# EAGLE design Non-Contact Switch v1 (EAGLE 9.6.0)
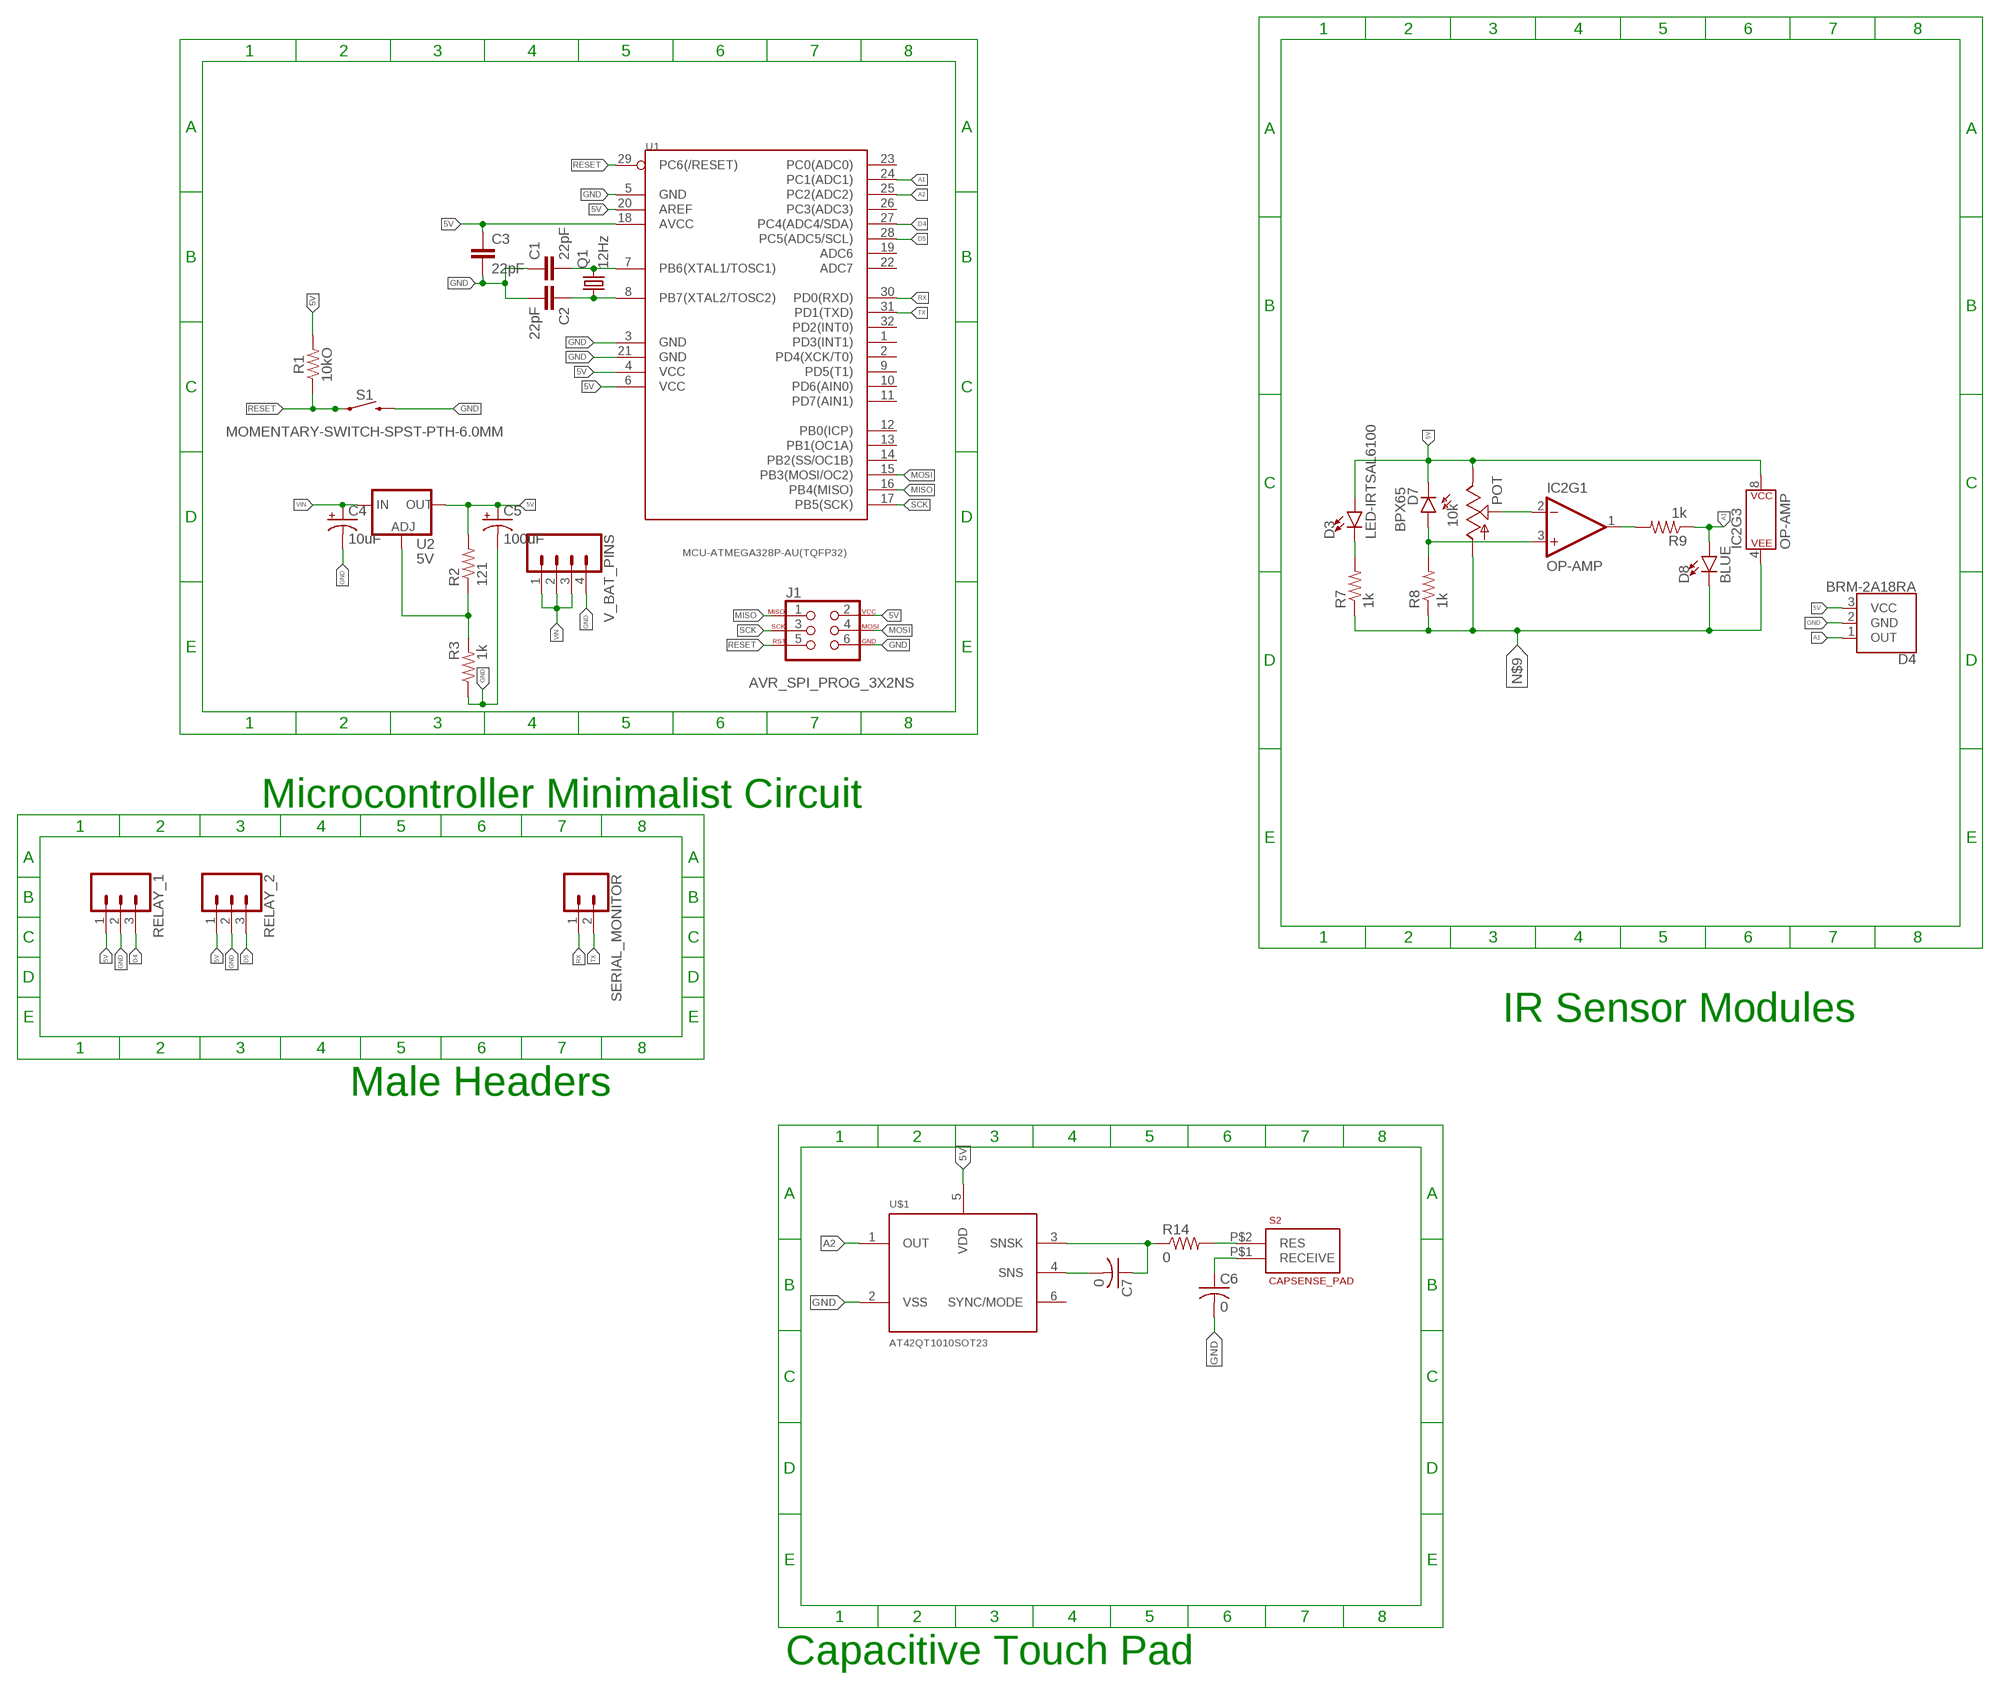
[diagram p0: schematic, sheet 1]

## Parts
C1  22pF  C-EUC0603  [C0603]
C2  22pF  C-EUC0603  [C0603]
C3  22pF  C-EUC0603  [C0603]
C4  10uF  10UF-POLAR-0603-6.3V-20%(TANT)  [0603-POLAR]
C5  100uF  10UF-POLAR-0603-6.3V-20%(TANT)  [0603-POLAR]
C6  0  C-USC0603K  [C0603K]
C7  0  C-USC0603K  [C0603K]
D3  LED-IRTSAL6100  [LED_5MM]
D4  BRM-2A18RA  [BRM-2508]
D7  BPX65  [BPX65]
D8  BLUE  LED-BLUE0603  [LED-0603]
IC2  OP-AMP  OPAMP-DUALU  [SO08]
J1  AVR_SPI_PROG_3X2NS  [2X3-NS]
POT  10k  TRIM_US-PT10  [PT-10]
Q1  12Hz  CRYSTALHC49UP  [HC49UP]
R1  10kO  1.8MOHM  [0603]
R2  121  R-US_R0603  [R0603]
R3  1k  R-US_R0603  [R0603]
R7  1k  R-US_R0603  [R0603]
R8  1k  R-US_R0603  [R0603]
R9  1k  R-US_R0603  [R0603]
R14  0  R-US_R0603  [R0603]
RELAY_1  CONN_031X03_NO_SILK  [1X03_NO_SILK]
RELAY_2  CONN_031X03_NO_SILK  [1X03_NO_SILK]
S1  MOMENTARY-SWITCH-SPST-PTH-6.0MM  [TACTILE_SWITCH_PTH_6.0MM]
S2  CAPSENSE_PAD  [CAPSENSE_PAD]
SERIAL_MONITOR  CONN_02  [1X02]
U1  MCU-ATMEGA328P-AU(TQFP32)  [TQFP32-0.8-7X7MM]
U2  5V  V_REG_LM1117SOT223  [SOT223]
U$1  AT42QT1010SOT23  [SOT23-6]
V_BAT_PINS  CONN_04LOCK  [1X04_LOCK]

## Nets
5V: C3.1 C5.+ D3.A D4.3(VCC) D7.K(C) IC2.8(P$V+) J1.2 POT.E R1.2 R2.2 RELAY_1.1 RELAY_2.1 U1.4(VCC) U1.6(VCC) U1.18(AVCC) U1.20(AREF) U2.2(OUT) U2.4(OUT) U$1.5(VDD)
A1: D4.1(OUT) D8.A R9.1 U1.24(PC1(ADC1))
A2: U1.25(PC2(ADC2)) U$1.1(OUT)
D4: RELAY_1.3 U1.27(PC4(ADC4/SDA))
D5: RELAY_2.3 U1.28(PC5(ADC5/SCL))
GND: C1.1 C2.2 C3.2 C4.- C5.- C6.2 D4.2(GND) IC2.2(-IN) J1.6 POT.S R3.1 RELAY_1.2 RELAY_2.2 S1.3 U1.3(GND) U1.5(GND) U1.21(GND) U$1.2(VSS) V_BAT_PINS.4
MISO: J1.1 U1.16(PB4(MISO))
MOSI: J1.4 U1.15(PB3(MOSI/OC2))
N$1: C1.2 Q1.2 U1.7(PB6(XTAL1/TOSC1))
N$2: C2.1 Q1.1 U1.8(PB7(XTAL2/TOSC2))
N$3: C6.1 S2.P$1(RECEIVE)
N$4: D7.A IC2.3(+IN) R8.2
N$5: D3.K(C) R7.2
N$7: IC2.1(OUT) R9.2
N$8: R2.1 R3.2 U2.1(ADJ)
N$9: D8.C IC2.4(P$V-) POT.A R7.1 R8.1
N$15: R14.2 S2.P$2(RES)
N$17: C7.1 R14.1 U$1.3(SNSK)
N$19: C7.2 U$1.4(SNS)
RESET: J1.5 R1.1 S1.1 U1.29(PC6(/RESET))
RX: SERIAL_MONITOR.1 U1.30(PD0(RXD))
SCK: J1.3 U1.17(PB5(SCK))
TX: SERIAL_MONITOR.2 U1.31(PD1(TXD))
VIN: C4.+ U2.3(IN) V_BAT_PINS.1 V_BAT_PINS.2 V_BAT_PINS.3
Unconnected: IC2.5(+IN) IC2.6(-IN) IC2.7(OUT) U1.1(PD3(INT1)) U1.2(PD4(XCK/T0)) U1.9(PD5(T1)) U1.10(PD6(AIN0)) U1.11(PD7(AIN1)) U1.12(PB0(ICP)) U1.13(PB1(OC1A)) U1.14(PB2(SS/OC1B)) U1.19(ADC6) U1.22(ADC7) U1.23(PC0(ADC0)) U1.26(PC3(ADC3)) U1.32(PD2(INT0)) U$1.6(SYNC/MODE)

## Notes on the sheet
- Microcontroller Minimalist Circuit
- IR Sensor Modules
- Male Headers
- Capacitive Touch Pad

## Library data of the parts
C1-C3 = rcl:C-EU: CAPACITOR, European symbol; SPICEPREFIX: C
C4 = SparkFun-Capacitors:10UF-POLAR: 10.0µF polarized capacitors A capacitor is a passive two-terminal electrical component used to store electrical energy temporarily in an electric field.; PROD_ID: CAP-13210
C5 = SparkFun-Capacitors:10UF-POLAR: 10.0µF polarized capacitors A capacitor is a passive two-terminal electrical component used to store electrical energy temporarily in an electric field.; PROD_ID: CAP-13210; VALUE: 10uF
C6 C7 = rcl:C-US: CAPACITOR, American symbol; SPICEPREFIX: C
D3 = SparkFun-LED:LED-IR: Infrared LED (IR) Wavelength: 940nm Packages: TSAL6100 LTE302 - Side firing. Check SparkFun-Sensors.lbr for the receiver SparkFun Products: ZX Distance and Gesture Sensor <[https://www.sparkfun.com/products/12780]> Infrared Emitters and Detectors <https://www.sparkfun.com/products/241>; PROD_ID: DIO-12058
D4 = SparkFun-Sensors:BRM-2A18: BRM-2A18 IR Receiver The BRM-2A18 is miniaturized infrared receiver for remote control and other applications requiring improved ambient light rejection. Vertical package is a primary component on the ZX Distance and Gesture Sensor. RA package is not currently in-use. Example Datasheet <http://www.sinoskysun.com/upload/20110512/201105120447164615.PDF> SparkFun Products ZX Distance and Gesture Sensor <https://www.sparkfun.com/products/12780> (COM-12780)
D7 = opto-trans-siemens:BPX65: PHOTO DIODE; MPN: BPX65.; OC_FARNELL: 327451; OC_NEWARK: 06WX2764
D8 = SparkFun-LED:LED-BLUE: Blue SMD LED Used in manufacturing of various products at SparkFun Packages: 0603 - SMD 0603 package [Product Link] <http://www.digikey.com/product-detail/en/SMLE12BC7TT86/511-1589-2-ND/1641808> 1206 - SMD1206 package [Product Link] <http://www.digikey.com/product-detail/en/lite-on-inc/LTST-C150TBKT/160-1643-1-ND/573584> SparkFun Products: ESP8266 Thing-Dev Board <https://www.sparkfun.com/products/13711> RedBoard <https://www.sparkfun.com/products/12757>; PROD_ID: DIO-08575
IC2 = SparkFun-IC-Amplifiers:OPAMP-DUAL: Generic op-amp footprint This component is for the standard 358 pinning of a dual op-amp From the LM358 datasheet: Pin 1: Output A Pin 2: Inverting Input A Pin 3: Non-Inverting Input A Pin 4: Gnd Pin 5: Non-Inverting Input B Pin 6: Inverting Input B Pin 7: Output B Pin 8: V+; PROD_ID: NA-XXXXX
J1 = SparkFun-Connectors(1):AVR_SPI_PROG_3X2: AVR ISP 6 Pin This is the reduced ISP connector for AVR programming. Common on Arduino. This footprint will take up less PCB space and can be used with a 10-pin to 6-pin adapter such as SKU: BOB-08508 **Special note about "TEST_POINT" package. The stop mask is on the top side, so if you want your programming test points to be on the bottom of your board, make sure to place this package on the bottom side of the board. This also ensure that the orientation to program from the bottom side will be correct. SparkFun Products: SparkFun ISP Pogo Adapter <https://www.sparkfun.com/products/11591> - NS Tiny AVR Programmer <https://www.sparkfun.com/products/11801> -PTH
POT = pot:TRIM_US-: POTENTIOMETER
Q1 = crystal:CRYSTAL: CRYSTAL; OC_FARNELL: unknown; OC_NEWARK: unknown
R1 = SparkFun-Resistors:1.8MOHM: 1.8 MOhms ±5% 0.1W, 1/10W Chip Resistor 0603; PROD_ID: RES-13994; VALUE: 1.8M
R2 R3 R7-R9 R14 = rcl:R-US_: RESISTOR, American symbol; SPICEPREFIX: R
RELAY_1 RELAY_2 = SparkFun-Connectors:CONN_03: Multi connection point. Often used as Generic Header-pin footprint for 0.1 inch spaced/style header connections On any of the 0.1 inch spaced packages, you can populate with these: Break Away Headers - Straight <https://www.sparkfun.com/products/116> (PRT-00116) Break Away Male Headers - Right Angle <https://www.sparkfun.com/products/553> (PRT-00553) Female Headers <https://www.sparkfun.com/products/115> (PRT-00115) Break Away Headers - Machine Pin <https://www.sparkfun.com/products/117> (PRT-00117) Break Away Female Headers - Swiss Machine Pin <https://www.sparkfun.com/products/743> (PRT-00743) Stackable Header - 3 Pin (Female, 0.1") <https://www.sparkfun.com/products/13875> (PRT-13875) For SCREWTERMINALS and SPRING TERMINALS visit here: Screw Terimnals on SparkFun.com <https://www.sparkfun.com/search/results?term=Screw+Terminals> (5mm/3.5mm/2.54mm spacing) This device is also useful as a general connection point to wire up your design to another part of your project. Our various solder wires solder well into these plated through hole pads. Hook-Up Wire - Assortment (Stranded, 22 AWG) <https://www.sparkfun.com/products/11375> (PRT-11375) Hook-Up Wire - Assortment (Solid Core, 22 AWG) <https://www.sparkfun.com/products/11367> (PRT-11367) View the entire wire category on our website here <https://www.sparkfun.com/categories/141> Special notes: Molex polarized connector foot print use with SKU : PRT-08232 with associated crimp pins and housings.
S1 = SparkFun-Switches(1):MOMENTARY-SWITCH-SPST: Momentary Switch (Pushbutton) - SPST Normally-open (NO) SPST momentary switches (buttons, pushbuttons). Variants PTH-12MM - 12mm square, through-hole Momentary Pushbutton Switch - 12mm Square <https://www.sparkfun.com/products/9190> (COM-09190) PTH-6.0MM, PTH-6.0MM-KIT - 6.0mm square, through-hole Mini Pushbutton Switch <https://www.sparkfun.com/products/97> (COM-00097) KIT package intended for soldering kit's - only one side of pads' copper is exposed. PTH-RIGHT-ANGLE-KIT - Right-angle, through-hole Right Angle Tactile Button <https://www.sparkfun.com/products/10791> - Used on SparkFun BigTime Watch Kit <https://www.sparkfun.com/products/11734> SMD-12MM - 12mm square, surface-mount Tactile Button - SMD (12mm) <https://www.sparkfun.com/products/12993> (COM-12993) Used on SparkFun PicoBoard <https://www.sparkfun.com/products/11888> SMD-4.5MM - 4.5mm Square Trackball Switch Used on SparkFun Blackberry Trackballer Breakout <https://www.sparkfun.com/products/13169> SMD-4.6MMX2.8MM - 4.60mm x 2.80mm, surface mount Used on SparkFun SAMD21 Mini Breakout <https://www.sparkfun.com/products/13664> SMD-5.2MM, SMD-5.2-REDUNDANT - 5.2mm square, surface-mount Mini Pushbutton Switch - SMD <https://www.sparkfun.com/products/8720> (COM-08720) Used on Arduino Pro Mini <https://www.sparkfun.com/products/11114> REDUNDANT package connects both switch circuits together SMD-6.0X3.5MM - 6.0 x 3.5mm, surface mount Momentary Reset Switch SMD <https://www.sparkfun.com/products/8229> (COM-08229) SMD-6.2MM-TALL - 6.2mm square, surface mount Tactile Button - SMD (6mm) <https://www.sparkfun.com/products/12992> Used on SparkFun Digital Sandbox <https://www.sparkfun.com/products/12651> SMD-RIGHT-ANGLE - Right-angle, surface mount Used on SparkFun Block for Intel® Edison - Arduino <https://www.sparkfun.com/products/13036>; PROD_ID: SWCH-08441; SF_SKU: COM-00097
S2 = SparkFun-Retired:CAPSENSE_PAD: Generic copper pad for a capacitive touch sensor.
SERIAL_MONITOR = SparkFun-Connectors:CONN_02: Multi connection point. Often used as Generic Header-pin footprint for 0.1 inch spaced/style header connections On any of the 0.1 inch spaced packages, you can populate with these: Break Away Headers - Straight <https://www.sparkfun.com/products/116> (PRT-00116) Break Away Male Headers - Right Angle <https://www.sparkfun.com/products/553> (PRT-00553) Female Headers <https://www.sparkfun.com/products/115> (PRT-00115) Break Away Headers - Machine Pin <https://www.sparkfun.com/products/117> (PRT-00117) Break Away Female Headers - Swiss Machine Pin <https://www.sparkfun.com/products/743> (PRT-00743) For SCREWTERMINALS and SPRING TERMINALS visit here: Screw Terimnals on SparkFun.com <https://www.sparkfun.com/search/results?term=Screw+Terminals> (5mm/3.5mm/2.54mm spacing) This device is also useful as a general connection point to wire up your design to another part of your project. Our various solder wires solder well into these plated through hole pads. Hook-Up Wire - Assortment (Stranded, 22 AWG) <https://www.sparkfun.com/products/11375> (PRT-11375) Hook-Up Wire - Assortment (Solid Core, 22 AWG) <https://www.sparkfun.com/products/11367> (PRT-11367) View the entire wire category on our website here <https://www.sparkfun.com/categories/141> Special notes: Molex polarized connector foot print use with: PRT-08233 with associated crimp pins and housings. 2.54_SCREWTERM for use with PRT-10571. 3.5mm Screw Terminal footprints for PRT-08084 5mm Screw Terminal footprints for use with PRT-08432
U1 = MCU-ATMEGA328P-AU_TQFP32_:MCU-ATMEGA328P-AU(TQFP32): 310010049; AVAILABILITY: Unavailable; DESCRIPTION: Microcontroller Mcu, 8 Bit, Atmega, 20mhz, Tqfp-32; MF: Microchip; MP: ATMEGA328P-AU; PACKAGE: TQFP-32 Microchip; PRICE: None
U2 = SparkFun-IC-Power:V_REG_LM1117: Voltage Regulator LM1117 Standard adjustable voltage regulator but in SMD form. Spark Fun Electronics SKU : COM-00595; PROD_ID: VREG-08170
U$1 = SparkFun-Sensors:AT42QT1010: Atmel AT42QT1010 The AT42QT1010 (QT1010) is a digital burst mode charge-transfer (QT™) sensor that is capable of detecting nearproximityor touch, making it ideal for implementing touch controls.The QT1010 is designed specifically for human interfaces, like control panels, appliances, toys, lighting controls, or anywhere a mechanical switch or button may be found. It includes all hardware and signal processing functions necessary to provide stable sensing under a wide variety of changing conditions. Only a single low-cost capacitor is required for operation. Datasheet <http://www.atmel.com/images/Atmel-9541-AT42-QTouch-BSW-AT42QT1010_Datasheet.pdf> Sparkfun Products Sparkfun Capacitive Touch Breakout <https://www.sparkfun.com/products/12041> (SEN-12041)
V_BAT_PINS = SparkFun-Connectors:CONN_04: Multi connection point. Often used as Generic Header-pin footprint for 0.1 inch spaced/style header connections On any of the 0.1 inch spaced packages, you can populate with these: Break Away Headers - Straight <https://www.sparkfun.com/products/116> (PRT-00116) Break Away Male Headers - Right Angle <https://www.sparkfun.com/products/553> (PRT-00553) Female Headers <https://www.sparkfun.com/products/115> (PRT-00115) Break Away Headers - Machine Pin <https://www.sparkfun.com/products/117> (PRT-00117) Break Away Female Headers - Swiss Machine Pin <https://www.sparkfun.com/products/743> (PRT-00743) For SCREWTERMINALS and SPRING TERMINALS visit here: Screw Terimnals on SparkFun.com <https://www.sparkfun.com/search/results?term=Screw+Terminals> (5mm/3.5mm/2.54mm spacing) This device is also useful as a general connection point to wire up your design to another part of your project. Our various solder wires solder well into these plated through hole pads. Hook-Up Wire - Assortment (Stranded, 22 AWG) <https://www.sparkfun.com/products/11375> (PRT-11375) Hook-Up Wire - Assortment (Solid Core, 22 AWG) <https://www.sparkfun.com/products/11367> (PRT-11367) View the entire wire category on our website here <https://www.sparkfun.com/categories/141> Special notes: Molex polarized connector foot print use with SKU : PRT-08231 with associated crimp pins and housings. 1MM SMD Version SKU: PRT-10208; PROD_ID: CONN-09696

## Board
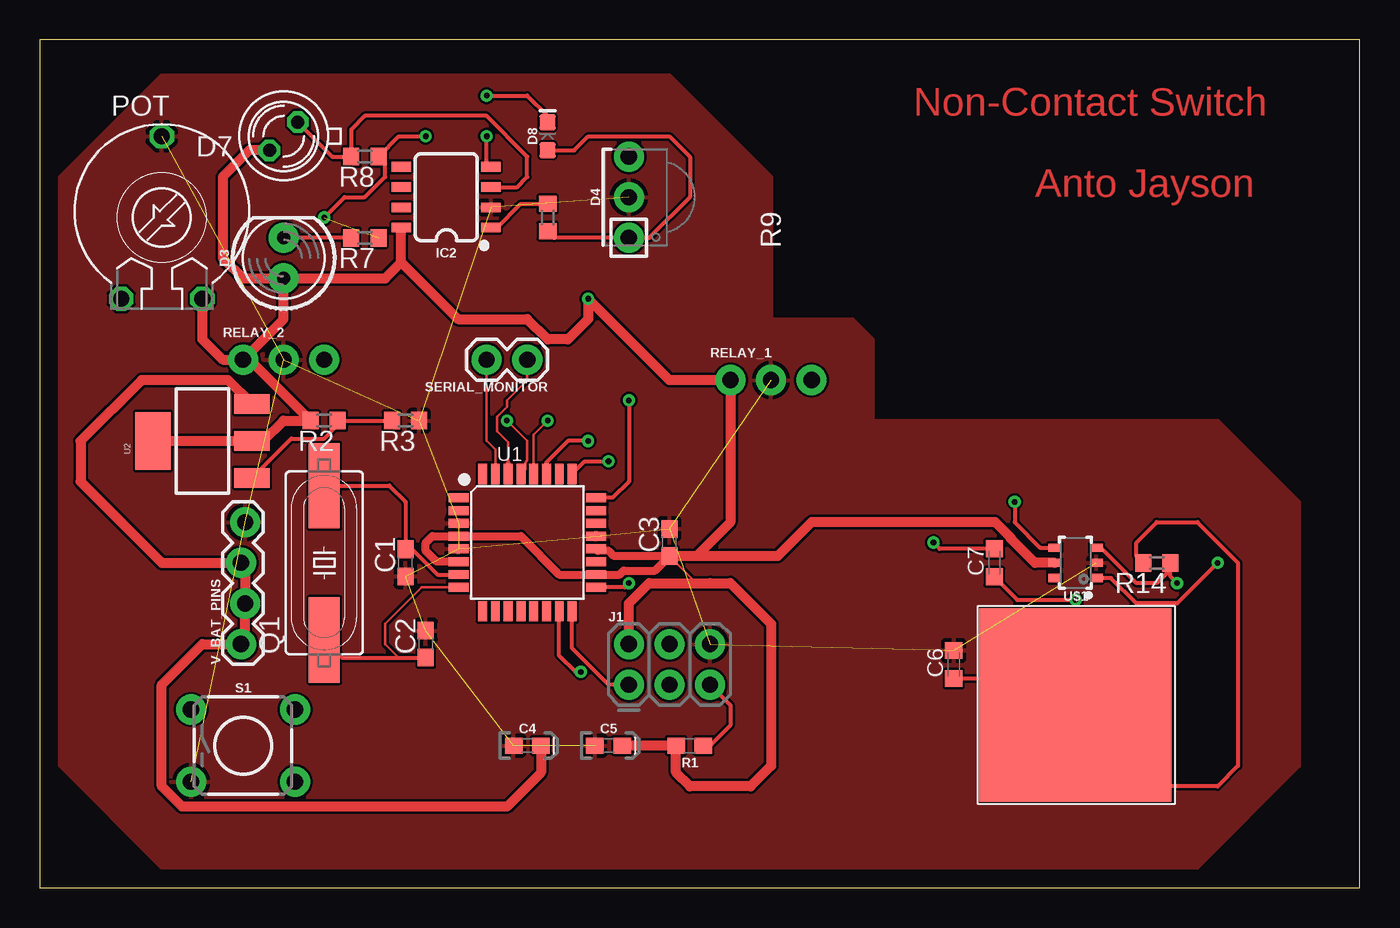
[diagram p1: board, top side]
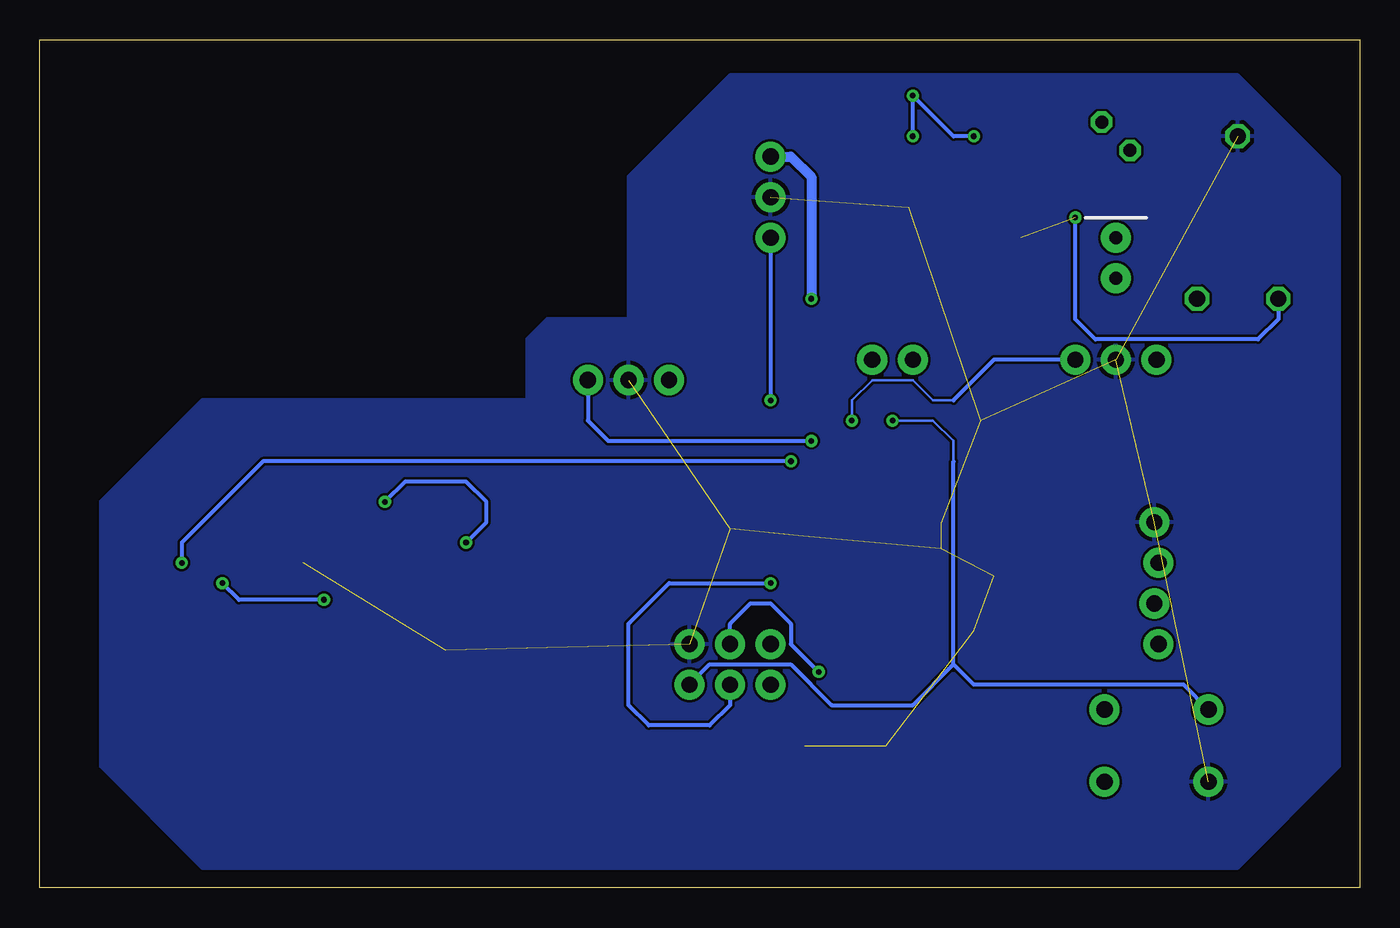
[diagram p2: board, bottom side, seen from below]

Size 82.53 x 53.01 mm. Coordinates in mm from the lower left corner, seen from the top.
Outline: 0,0 82.53,0 82.53,53.01 0,53.01 0,0
Copper layers (1*16): Top 0.035mm / dielectric 1.5mm / Bottom 0.035mm
Design rules "default": minimum track width 6mil, minimum drill 0.35mm, track to track 6mil, track to pad 6mil, pad to pad 6mil, via to via 6mil, smd to smd 6mil, copper to edge 40mil, drill to drill 6mil, minimum pad ring 10mil, minimum via ring 8mil, stop-mask expansion 4mil, vias tented up to drill 0mil, thermal gap 10mil

### Footprints (pad centres in the part's own frame; a part is rotated, then mirrored left to right if it is on the bottom)
C0603 = smd 1.1 x 1: 1 -0.85,0; 2 0.85,0
0603-POLAR = smd 1.1 x 1: + 0.85,0; - -0.85,0
C0603K = smd 1.05 x 1.08: 1 -0.875,0; 2 0.875,0
LED_5MM = drill 0.813 pad 1.88: A -1.27,0; K 1.27,0
BRM-2508 = drill 1.016 pad 1.88: 1 -2.54,0; 2 0,0; 3 2.54,0
BPX65 = drill 0.813 octagon: A -0.889,-0.889; K 0.889,0.889
LED-0603 = smd 1 x 1: A -0.877,0; C 0.877,0
SO08 = smd 0.6 x 1.2: 1 -1.905,-2.8; 2 -0.635,-2.8; 3 0.635,-2.8; 4 1.905,-2.8; 5 1.905,2.8; 6 0.635,2.8; 7 -0.635,2.8; 8 -1.905,2.8
2X3-NS = drill 1.016 pad 1.88: 1 -2.54,-1.27; 2 -2.54,1.27; 3 0,-1.27; 4 0,1.27; 5 2.54,-1.27; 6 2.54,1.27
PT-10 = drill 1.016 octagon: A -2.54,-5.08; E 2.54,-5.08; S 0,5.08
HC49UP = smd 5.334 x 1.93: 1 -4.826,0; 2 4.826,0
0603 = smd 1.1 x 1: 1 -0.85,0; 2 0.85,0
R0603 = smd 1 x 1.1: 1 -0.85,0; 2 0.85,0
1X03_NO_SILK = drill 1.016 pad 1.88: 1 0,0; 2 2.54,0; 3 5.08,0
TACTILE_SWITCH_PTH_6.0MM = drill 1.016 pad 1.88: 1 -3.251,2.261; 2 3.251,2.261; 3 -3.251,-2.261; 4 3.251,-2.261
CAPSENSE_PAD = smd 12 x 6.1: P$1 0,3; P$2 0,-3
1X02 = drill 1.016 pad 1.88: 1 0,0; 2 2.54,0
TQFP32-0.8-7X7MM = smd 1.27 x 0.559: 1 -4.293,2.8; 2 -4.293,2; 3 -4.293,1.2; 4 -4.293,0.4; 5 -4.293,-0.4; 6 -4.293,-1.2; 7 -4.293,-2; 8 -4.293,-2.8; 17 4.293,-2.8; 18 4.293,-2; 19 4.293,-1.2; 20 4.293,-0.4; 21 4.293,0.4; 22 4.293,1.2; 23 4.293,2; 24 4.293,2.8 | smd 0.559 x 1.27: 9 -2.8,-4.293; 10 -2,-4.293; 11 -1.2,-4.293; 12 -0.4,-4.293; 13 0.4,-4.293; 14 1.2,-4.293; 15 2,-4.293; 16 2.8,-4.293; 25 2.8,4.293; 26 2,4.293; 27 1.2,4.293; 28 0.4,4.293; 29 -0.4,4.293; 30 -1.2,4.293; 31 -2,4.293; 32 -2.8,4.293
SOT223 = smd 1.219 x 2.235: 1 -2.311,-3.099; 2 0,-3.099; 3 2.311,-3.099 | smd 3.6 x 2.2: 4 0,3.099
SOT23-6 = smd 0.51 x 0.8: 1 -0.95,-1.3; 2 0,-1.3; 3 0.95,-1.3; 4 0.95,1.3; 5 0,1.3; 6 -0.95,1.3
1X04_LOCK = drill 1.016 pad 1.88: 1 0,0.127; 2 2.54,-0.127; 3 5.08,0.127; 4 7.62,-0.127

### Placement (x,y rotation side)
C1  22.86,20.32 90 top
C2  24.13,15.24 90 top
C3  39.37,21.59 90 top
C4  30.48,8.89 0 top
C5  35.56,8.89 0 top
C6  57.15,13.97 90 top
C7  59.69,20.32 90 top
D3  15.24,39.37 90 top
D4  36.83,43.18 90 top
D7  15.24,46.99 180 top
D8  31.75,46.99 90 top
IC2  25.4,43.18 90 top
J1  39.37,13.97 0 top
POT  7.62,41.91 0 top
Q1  17.78,20.32 90 top
R1  40.64,8.89 180 top
R2  17.78,29.21 180 top
R3  22.86,29.21 180 top
R7  20.32,40.64 180 top
R8  20.32,45.72 180 top
R9  31.75,41.91 90 top
R14  69.85,20.32 180 top
RELAY_1  43.18,31.75 0 top
RELAY_2  12.7,33.02 0 top
S1  12.7,8.89 0 top
S2  64.77,11.43 0 top
SERIAL_MONITOR  30.48,33.02 180 top
U1  30.48,21.59 0 top
U2  10.16,27.94 90 top
U$1  64.77,20.32 90 top
V_BAT_PINS  12.7,15.24 90 top

### Tracks (layer width: path | path; a pad name or v marks a point on that pad's centre or on a via)
5V  (via drill 0.35)
  Top 0.152: C3.1 41.06,19.05 41.91,19.05
  Top 0.508: U1.20 34.89,21.08 35.58,21.08 35.91,20.74 C3.1 38.47,19.84 36.51,19.84 36.26,19.59 U1.18 32.48,19.59 30.08,21.99 U1.4 24.53,21.99 24.13,21.59 24.13,21.07 24.81,20.39 U1.6
  Top 0.635: D7.K 13.08,46.1 11.43,44.45 11.43,39.37 12.7,38.1 D3.A | 22.6,39.11 21.59,38.1 D3.A | 22.6,39.11 IC2.8 | 41.06,20.74 C3.1 | 41.06,20.74 43.18,22.86 RELAY_1.1 39.37,31.75 v34.29,36.83 34.29,35.56 33.02,34.29 31.75,34.29 30.48,35.56 26.15,35.56 22.6,39.11 | U$1.5 62.23,20.32 60.7,21.85 60.7,21.92 59.76,22.86 48.26,22.86 46.14,20.74 41.06,20.74 | C5.+ R1.2 39.79,7.2 40.64,6.35 44.45,6.35 45.72,7.62 45.72,16.51 43.18,19.05 41.91,19.05 38.1,19.05 36.83,17.78 J1.2 | U2.4 U2.2 13.97,27.94 15.24,29.21 R2.2 13.12,33.02 RELAY_2.1 | RELAY_2.1 15.24,35.56 D3.A | POT.E 10.16,34.29 11.43,33.02 RELAY_2.1
  Bottom 0.635: D4.3 35.56,45.72 34.29,44.45 v34.29,36.83
A1  (via drill 0.35)
  Top 0.254: v36.83,30.48 36.83,25.4 35.82,24.39 U1.24 | R9.1 32.17,40.64 D4.1 38.1,40.64 40.64,43.18 40.64,45.72 39.37,46.99 34.29,46.99 33.41,46.11 D8.A
  Bottom 0.254: D4.1 v36.83,30.48
A2  (via drill 0.35)
  Top 0.254: U1.25 34.07,26.67 v35.56,26.67 | U$1.1 66.99,19.37 68.58,17.78 71.12,17.78 v73.66,20.32
  Bottom 0.254: v73.66,20.32 73.66,21.59 68.58,26.67 v35.56,26.67
D4  (via drill 0.35)
  Top 0.254: v34.29,27.94 33.02,27.94 31.68,26.6 U1.27
  Bottom 0.254: RELAY_1.3 48.26,29.21 46.99,27.94 v34.29,27.94
D5  (via drill 0.35)
  Top 0.152: U1.28 30.88,28.34 v31.75,29.21
  Bottom 0.152: v31.75,29.21 31.75,30.48 30.48,31.75 27.94,31.75 26.67,30.48 25.4,30.48
  Bottom 0.254: RELAY_2.3 22.86,33.02 25.4,30.48
GND  (18 unrouted)
  pour Top: 35.56,1.27 7.62,1.27 1.27,7.62 1.27,44.45 7.62,50.8 39.37,50.8 45.72,44.45 45.72,35.56 50.8,35.56 52.07,34.29 52.07,29.21 73.66,29.21 77.47,25.4 78.74,24.13 78.74,7.62 72.39,1.27
  pour Bottom: 31.75,1.27 7.62,1.27 1.27,7.62 1.27,44.45 7.62,50.8 39.37,50.8 45.72,44.45 45.72,35.56 50.8,35.56 52.07,34.29 52.07,30.48 72.39,30.48 78.74,24.13 78.74,7.62 72.39,1.27 71.12,1.27
MISO
  Top 0.254: J1.1 35.56,12.7 33.28,14.98 U1.16
MOSI  (via drill 0.35)
  Top 0.254: v33.83,13.51 33.48,13.51 32.48,14.51 U1.15
  Bottom 0.254: J1.4 39.37,16.51 38.1,17.78 36.83,17.78 35.56,16.51 35.56,15.24 v33.83,13.51
N$1
  Top 0.254: U1.7 24.86,19.59 23.28,21.17 C1.2 22.86,24.13 21.84,25.15 Q1.2
N$2
  Top 0.152: C2.1 22.44,14.39 21.59,15.24 21.59,16.51 23.87,18.79 U1.8
  Top 0.254: Q1.1 18.88,14.39 C2.1
N$3
  Top 0.254: C6.1 63.44,13.1 S2.P$1
N$4
  Top 0.254: IC2.3 29.84,43.82 30.48,44.45 30.48,45.72 27.94,48.26 20.32,48.26 19.47,47.41 R8.2 18.29,45.72 D7.A
N$5
  Top 0.254: R7.2 D3.K
N$7
  Top 0.254: IC2.1 28.58,41.28 30.06,42.76 R9.2
N$8
  Top 0.254: R3.2 R2.1 18.63,28.94 17.78,28.09 15.72,28.09 U2.1
N$9  (via drill 0.35)  (1 unrouted)
  Top 0.254: v17.78,41.91 19.05,43.18 20.32,43.18 21.59,44.45 21.59,45.3 R8.1 22.44,46.99 v24.13,46.99 | v27.94,49.53 30.48,49.53 31.75,48.26 D8.C | IC2.4 27.94,45.34 v27.94,46.99
  Bottom 0.254: POT.A 5.08,35.56 6.35,34.29 16.51,34.29 17.78,35.56 v17.78,41.91 | v24.13,46.99 25.4,46.99 v27.94,49.53 v27.94,46.99
N$15
  Top 0.254: R14.2 68.58,20.74 68.58,21.59 69.85,22.86 72.39,22.86 74.93,20.32 74.93,7.62 73.66,6.35 67.31,6.35 65.23,8.43 S2.P$2
N$17  (via drill 0.35)
  Top 0.254: U$1.3 66.36,21.27 68.58,19.05 69.85,19.05 70.7,19.9 R14.1 70.7,19.47 v71.12,19.05 | C7.1 61.12,18.01 v64.77,18.01
  Bottom 0.254: v64.77,18.01 70.08,18.01 v71.12,19.05
N$19  (via drill 0.35)
  Top 0.254: C7.2 56.27,21.2 v55.88,21.59 | v60.96,24.13 60.96,22.86 62.55,21.27 U$1.4
  Bottom 0.254: v55.88,21.59 54.61,22.86 54.61,24.13 55.88,25.4 59.69,25.4 v60.96,24.13
RESET  (via drill 0.35)
  Top 0.152: v29.21,29.21 30.48,27.94 30.48,26.72 30.37,26.61 30.37,26.18 U1.29
  Top 0.254: J1.5 43.18,11.43 43.18,10.16 41.91,8.89 R1.1
  Bottom 0.152: 25.4,26.67 25.4,27.94 26.67,29.21 v29.21,29.21
  Bottom 0.254: S1.1 11,12.7 24.13,12.7 25.4,13.97 | 25.4,13.97 25.4,26.67 | J1.5 40.64,13.97 35.56,13.97 33.02,11.43 27.94,11.43 25.4,13.97
RX
  Top 0.152: U1.30 29.28,27.87 28.6,28.55 28.6,29.46 29.21,30.07 29.21,30.48 30.48,31.75 SERIAL_MONITOR.1
  Top 0.254: U1.30 29.28,26.6
SCK  (via drill 0.35)
  Top 0.254: v36.83,19.05 36.57,18.79 U1.17
  Bottom 0.254: J1.3 39.37,11.43 40.64,10.16 44.45,10.16 45.72,11.43 45.72,16.51 43.18,19.05 v36.83,19.05
TX
  Top 0.152: U1.31 28.48,27.4 27.94,27.94 SERIAL_MONITOR.2
VIN
  Top 0.635: C4.+ 31.33,7.2 29.21,5.08 8.89,5.08 7.62,6.35 7.62,12.7 10.16,15.24 V_BAT_PINS.1 12.83,15.49 V_BAT_PINS.2 12.83,20.07 V_BAT_PINS.3 7.62,20.32 2.54,25.4 2.54,27.94 6.35,31.75 11.76,31.75 U2.3

### Text on the board
Top: Non-Contact Switch | Anto Jayson